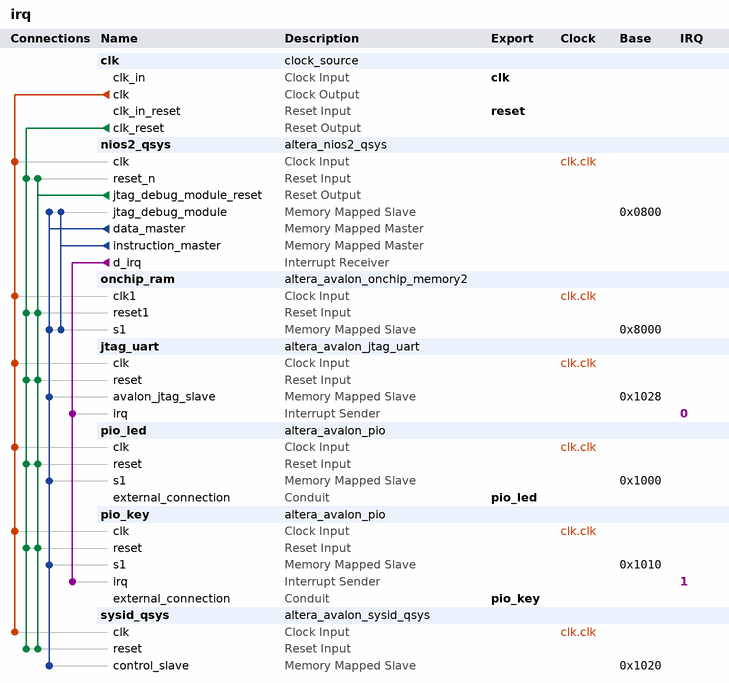
[diagram p0: system contents]
# Platform Designer (Qsys) system irq, Cyclone IV E EP4CE10F17C8
# Parameters at their usual value, and those the tool derives, are not listed.
package require -exact qsys 13.1
create_system irq
set_project_property DEVICE_FAMILY {Cyclone IV E}
set_project_property DEVICE EP4CE10F17C8

add_instance clk clock_source 13.1
set_instance_parameter_value clk clockFrequency 100000000

add_instance nios2_qsys altera_nios2_qsys 13.1
set_instance_parameter_value nios2_qsys muldiv_divider true
set_instance_parameter_value nios2_qsys resetSlave onchip_ram.s1
set_instance_parameter_value nios2_qsys mmu_TLBMissExcSlave None
set_instance_parameter_value nios2_qsys exceptionSlave onchip_ram.s1
set_instance_parameter_value nios2_qsys breakSlave nios2_qsys.jtag_debug_module
set_instance_parameter_value nios2_qsys impl Fast
set_instance_parameter_value nios2_qsys icache_size 4096

add_instance onchip_ram altera_avalon_onchip_memory2 13.1
set_instance_parameter_value onchip_ram dataWidth 32
set_instance_parameter_value onchip_ram dualPort false
set_instance_parameter_value onchip_ram initMemContent true
set_instance_parameter_value onchip_ram initializationFileName onchip_mem.hex
set_instance_parameter_value onchip_ram memorySize 20480

add_instance jtag_uart altera_avalon_jtag_uart 13.1
set_instance_parameter_value jtag_uart simInteractiveOptions NO_INTERACTIVE_WINDOWS

add_instance pio_led altera_avalon_pio 13.1
set_instance_parameter_value pio_led direction Output
set_instance_parameter_value pio_led width 4

add_instance pio_key altera_avalon_pio 13.1
set_instance_parameter_value pio_key bitClearingEdgeCapReg true
set_instance_parameter_value pio_key direction Input
set_instance_parameter_value pio_key generateIRQ true
set_instance_parameter_value pio_key width 1

add_instance sysid_qsys altera_avalon_sysid_qsys 13.1
set_instance_parameter_value sysid_qsys id 0

# connections
add_connection clk.clk jtag_uart.clk clock
add_connection clk.clk nios2_qsys.clk clock
add_connection clk.clk onchip_ram.clk1 clock
add_connection clk.clk pio_key.clk clock
add_connection clk.clk pio_led.clk clock
add_connection clk.clk sysid_qsys.clk clock
add_connection clk.clk_reset jtag_uart.reset reset
add_connection clk.clk_reset nios2_qsys.reset_n reset
add_connection clk.clk_reset onchip_ram.reset1 reset
add_connection clk.clk_reset pio_key.reset reset
add_connection clk.clk_reset pio_led.reset reset
add_connection clk.clk_reset sysid_qsys.reset reset
add_connection nios2_qsys.jtag_debug_module_reset jtag_uart.reset reset
add_connection nios2_qsys.jtag_debug_module_reset nios2_qsys.reset_n reset
add_connection nios2_qsys.jtag_debug_module_reset onchip_ram.reset1 reset
add_connection nios2_qsys.jtag_debug_module_reset pio_key.reset reset
add_connection nios2_qsys.jtag_debug_module_reset pio_led.reset reset
add_connection nios2_qsys.jtag_debug_module_reset sysid_qsys.reset reset
add_connection nios2_qsys.data_master jtag_uart.avalon_jtag_slave avalon
set_connection_parameter_value nios2_qsys.data_master/jtag_uart.avalon_jtag_slave baseAddress 0x1028
add_connection nios2_qsys.data_master nios2_qsys.jtag_debug_module avalon
set_connection_parameter_value nios2_qsys.data_master/nios2_qsys.jtag_debug_module baseAddress 0x0800
add_connection nios2_qsys.data_master onchip_ram.s1 avalon
set_connection_parameter_value nios2_qsys.data_master/onchip_ram.s1 baseAddress 0x8000
add_connection nios2_qsys.data_master pio_key.s1 avalon
set_connection_parameter_value nios2_qsys.data_master/pio_key.s1 baseAddress 0x1010
add_connection nios2_qsys.data_master pio_led.s1 avalon
set_connection_parameter_value nios2_qsys.data_master/pio_led.s1 baseAddress 0x1000
add_connection nios2_qsys.data_master sysid_qsys.control_slave avalon
set_connection_parameter_value nios2_qsys.data_master/sysid_qsys.control_slave baseAddress 0x1020
add_connection nios2_qsys.instruction_master nios2_qsys.jtag_debug_module avalon
set_connection_parameter_value nios2_qsys.instruction_master/nios2_qsys.jtag_debug_module baseAddress 0x0800
add_connection nios2_qsys.instruction_master onchip_ram.s1 avalon
set_connection_parameter_value nios2_qsys.instruction_master/onchip_ram.s1 baseAddress 0x8000
add_connection nios2_qsys.d_irq jtag_uart.irq interrupt
set_connection_parameter_value nios2_qsys.d_irq/jtag_uart.irq irqNumber 0
add_connection nios2_qsys.d_irq pio_key.irq interrupt
set_connection_parameter_value nios2_qsys.d_irq/pio_key.irq irqNumber 1

# exported interfaces
add_interface clk clock sink
set_interface_property clk EXPORT_OF clk.clk_in
add_interface reset reset sink
set_interface_property reset EXPORT_OF clk.clk_in_reset
add_interface pio_led conduit end
set_interface_property pio_led EXPORT_OF pio_led.external_connection
add_interface pio_key conduit end
set_interface_property pio_key EXPORT_OF pio_key.external_connection

set_interconnect_requirement {$system} qsys_mm.clockCrossingAdapter HANDSHAKE
set_interconnect_requirement {$system} qsys_mm.maxAdditionalLatency 1
set_interconnect_requirement {$system} qsys_mm.insertDefaultSlave false

save_system irq.qsys
